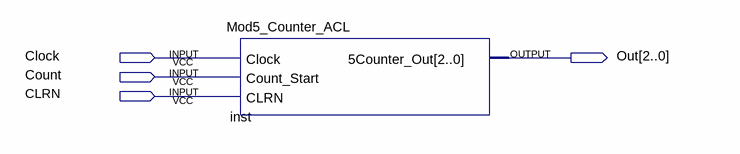
[diagram p0: schematic sheet]
// Quartus schematic M5C_ACL_Test.bdf as structural Verilog: 1 symbols, 4 pins
module M5C_ACL_Test (
  input  Clock,
  input  Count,
  input  CLRN,
  output [2:0] Out
);

  Mod5_Counter_ACL inst (.Clock(Clock), .Count_Start(Count), .CLRN(CLRN), .\5Counter_Out (Out));
endmodule
